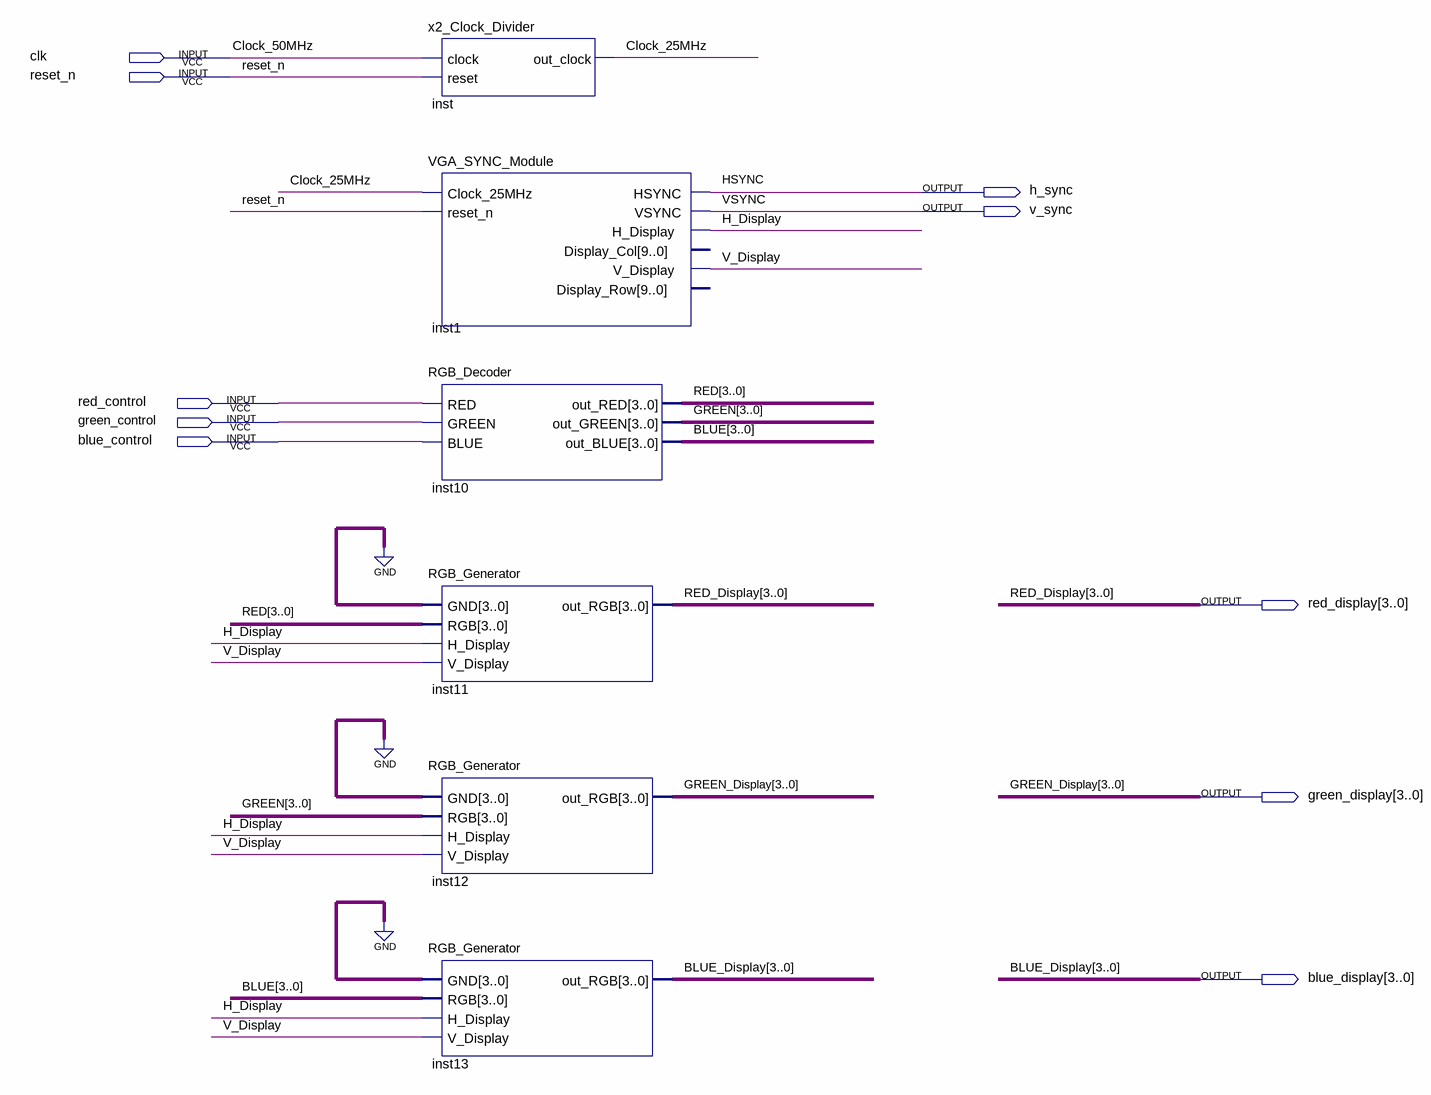
[diagram p0: schematic sheet]
// Quartus schematic VGA_Test_Module.bdf as structural Verilog: 6 symbols, 10 pins
module VGA_Test_Module (
  input  clk,
  input  reset_n,
  input  red_control,
  input  green_control,
  input  blue_control,
  output h_sync,
  output v_sync,
  output [3:0] red_display,
  output [3:0] green_display,
  output [3:0] blue_display
);

  wire Clock_25MHz, H_Display, V_Display;
  wire [3:0] BLUE, GREEN, RED;

  x2_Clock_Divider inst (.clock(clk), .reset(reset_n), .out_clock(Clock_25MHz));
  VGA_SYNC_Module inst1 (
    .Clock_25MHz(Clock_25MHz), .reset_n(reset_n), .HSYNC(h_sync), .VSYNC(v_sync), .H_Display(H_Display),
    .V_Display(V_Display));  // open: Display_Col, Display_Row
  RGB_Decoder inst10 (
    .RED(red_control), .GREEN(green_control), .BLUE(blue_control), .out_RED(RED), .out_GREEN(GREEN),
    .out_BLUE(BLUE));
  RGB_Generator inst11 (.GND(4'b0000), .RGB(RED), .H_Display(H_Display), .V_Display(V_Display), .out_RGB(red_display));
  RGB_Generator inst12 (
    .GND(4'b0000), .RGB(GREEN), .H_Display(H_Display), .V_Display(V_Display), .out_RGB(green_display));
  RGB_Generator inst13 (
    .GND(4'b0000), .RGB(BLUE), .H_Display(H_Display), .V_Display(V_Display), .out_RGB(blue_display));

  // Other names for the same wires on the sheet: Clock_50MHz = clk; HSYNC = h_sync; VSYNC = v_sync
endmodule
